# EAGLE design Controlador-ArduUri (EAGLE 9.0.0)
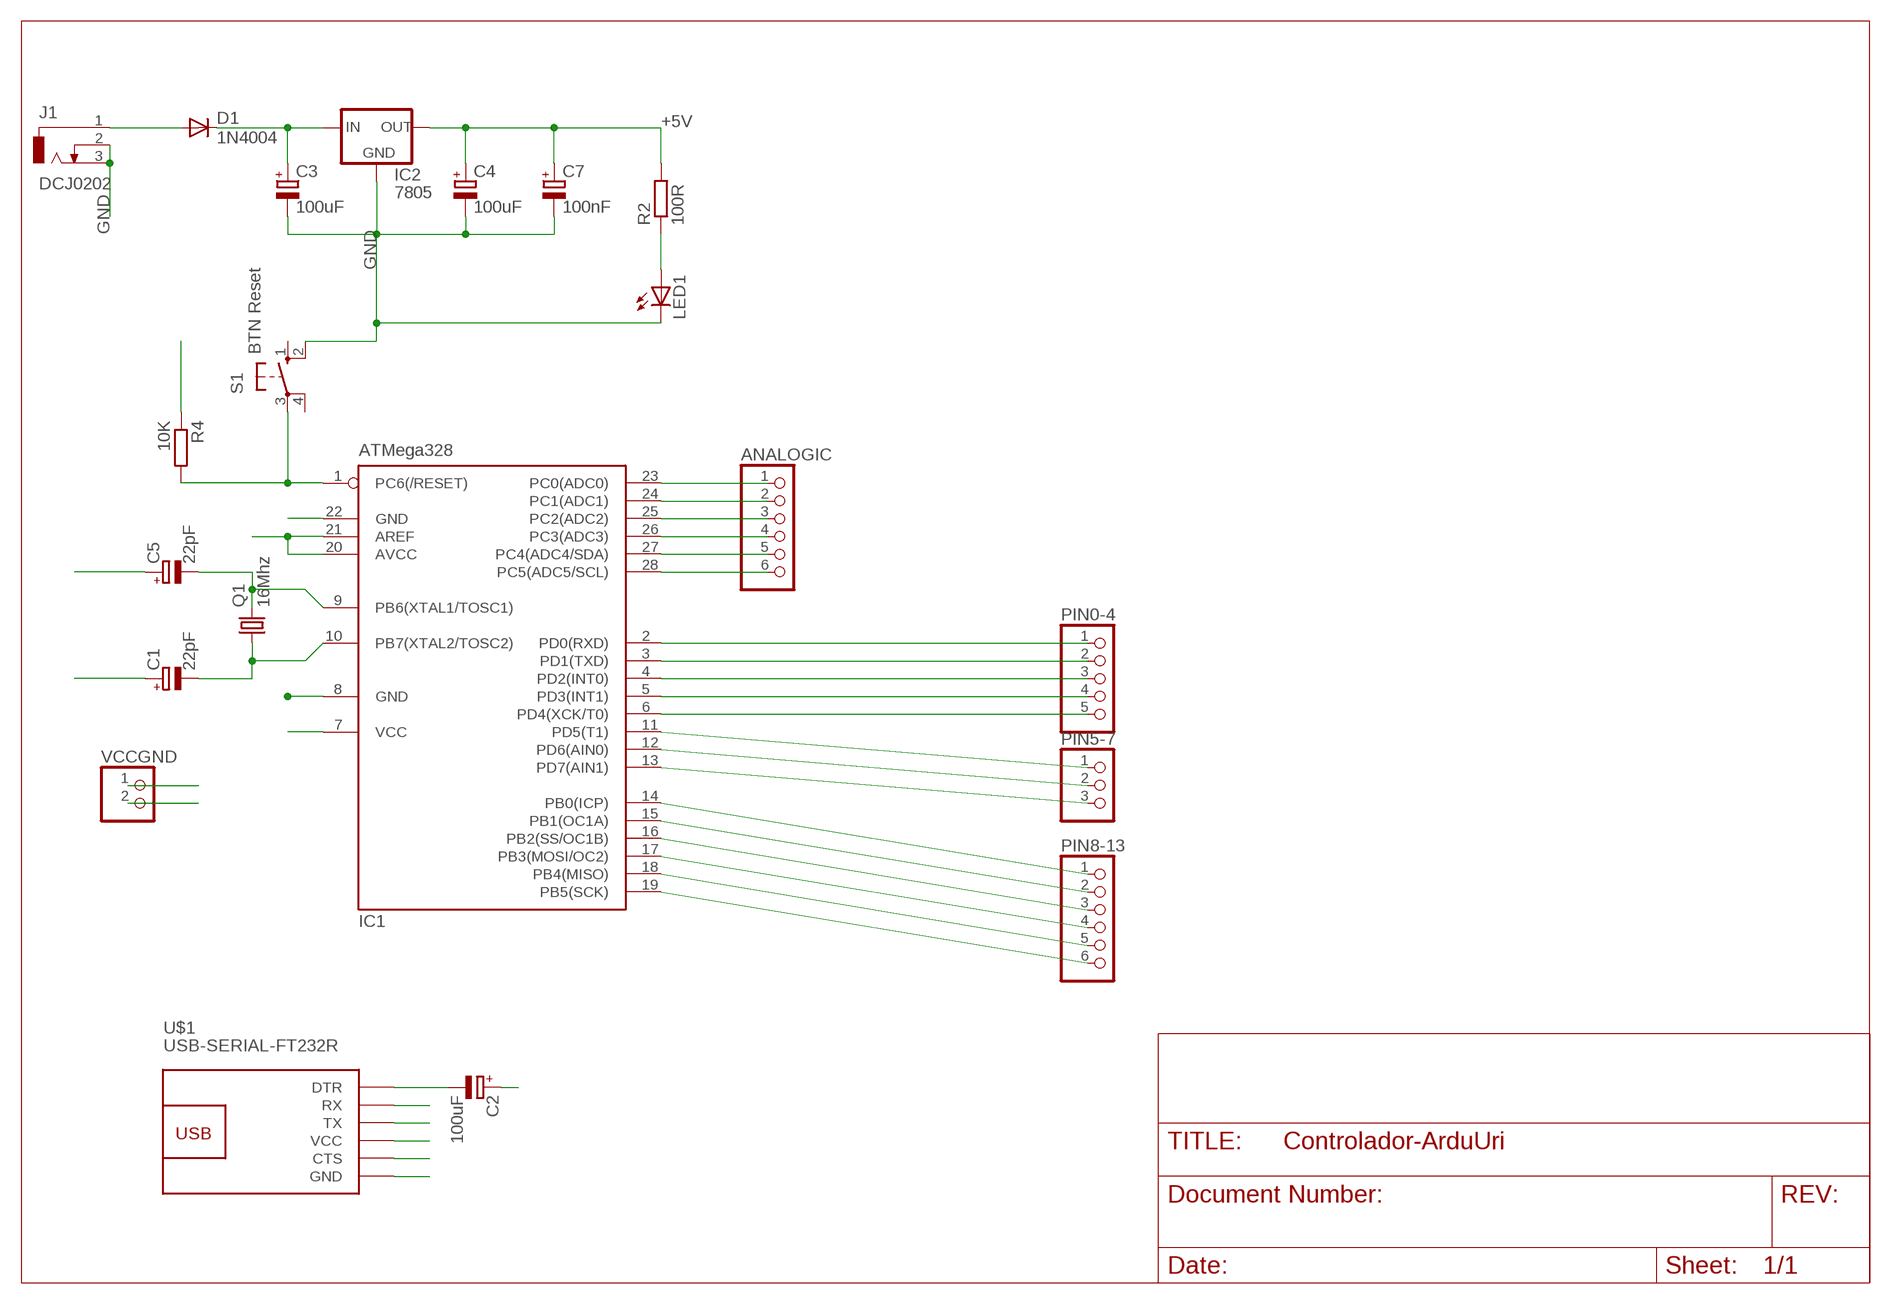
[diagram p0: schematic, sheet 1]

## Parts
ANALOGIC  PINHD-1X6  [1X06]
C1  22pF  CPOL-EUE2.5-5  [E2,5-5]
C2  100uF  CPOL-EUTAP5-50  [TAP5-50]
C3  100uF  CPOL-EUTAP5-50  [TAP5-50]
C4  100uF  CPOL-EUTAP5-50  [TAP5-50]
C5  22pF  CPOL-EUE2.5-5  [E2,5-5]
C7  100nF  CPOL-EUE2.5-5  [E2,5-5]
D1  1N4004  [DO41-10]
IC1  ATMega328  MEGA8-P  [DIL28-3]
IC2  7805  78XXL  [78XXL]
J1  DCJ0202  [DCJ0202]
LED1  LED5MM  [LED5MM]
PIN0-4  PINHD-1X5  [1X05]
PIN5-7  PINHD-1X3  [1X03]
PIN8-13  PINHD-1X6  [1X06]
Q1  16Mhz  CRYSTALHC49S  [HC49/S]
R2  100R  R-EU_0204/7  [0204/7]
R4  10K  R-EU_0204/7  [0204/7]
S1  BTN Reset  10-XX  [B3F-10XX]
U$1  USB-SERIAL-FT232R  [USB-SERIAL-FT232R]
VCCGND  PINHD-1X2  [1X02]

## Nets
+5V: C4.+ C7.+ IC1.7(VCC) IC1.20(AVCC) IC1.21(AREF) IC2.OUT R2.2 R4.1 U$1.4(VCC) VCCGND.1
DTR: C2.- U$1.1(DTR)
GND: C1.+ C3.- C4.- C5.+ C7.- IC1.8(GND) IC1.22(GND) IC2.GND J1.2 J1.3 LED1.K(C) S1.2(S1) U$1.6(GND) VCCGND.2
M1-A1: IC1.17(PB3(MOSI/OC2)) PIN8-13.4
M1-B1: IC1.16(PB2(SS/OC1B)) PIN8-13.3
M2-A1: IC1.12(PD6(AIN0)) PIN5-7.2
M2-B1: IC1.11(PD5(T1)) PIN5-7.1
N$1: C5.- IC1.9(PB6(XTAL1/TOSC1)) Q1.2
N$2: C1.- IC1.10(PB7(XTAL2/TOSC2)) Q1.1
N$5: D1.A J1.1
N$6: C3.+ D1.C IC2.IN
N$20: ANALOGIC.1 IC1.23(PC0(ADC0))
N$21: ANALOGIC.2 IC1.24(PC1(ADC1))
N$22: ANALOGIC.3 IC1.25(PC2(ADC2))
N$23: ANALOGIC.4 IC1.26(PC3(ADC3))
N$24: ANALOGIC.5 IC1.27(PC4(ADC4/SDA))
N$25: ANALOGIC.6 IC1.28(PC5(ADC5/SCL))
N$28: IC1.4(PD2(INT0)) PIN0-4.3
N$29: IC1.5(PD3(INT1)) PIN0-4.4
N$30: IC1.6(PD4(XCK/T0)) PIN0-4.5
N$31: IC1.13(PD7(AIN1)) PIN5-7.3
N$32: IC1.14(PB0(ICP)) PIN8-13.1
N$33: IC1.15(PB1(OC1A)) PIN8-13.2
N$34: IC1.18(PB4(MISO)) PIN8-13.5
N$35: IC1.19(PB5(SCK)) PIN8-13.6
N$40: U$1.5(CTS)
N$48: LED1.A R2.1
RESET: C2.+ IC1.1(PC6(/RESET)) R4.2 S1.3(P)
RX: IC1.2(PD0(RXD)) PIN0-4.1 U$1.3(TX)
TX: IC1.3(PD1(TXD)) PIN0-4.2 U$1.2(RX)
Unconnected: S1.1(S) S1.4(P1)

## Library data of the parts
ANALOGIC PIN8-13 = pinhead:PINHD-1X6: PIN HEADER
C1-C5 C7 = rcl:CPOL-EU: POLARIZED CAPACITOR, European symbol
D1 = diode:1N4004: DIODE general purpose rectifier, 1 A
IC1 = atmel:MEGA8-P: MICROCONTROLLER 8 Kbytes FLASH, 1 kbytes SRAM, 512 bytes EEPROM, USART, 4-channel 10 bit ADC, 2-channel 8 bit ADC Pin compatible with Atmega48, ATMega88, ATMega168 Source: avr.lbr; OC_FARNELL: unknown; OC_NEWARK: unknown
IC2 = v-reg:78XXL: VOLTAGE REGULATOR
J1 = con-jack:DCJ0202: DC POWER JACK Source: DCJ0202.pdf; OC_FARNELL: unknown; OC_NEWARK: unknown
LED1 = led:LED: LED OSRAM: - CHIPLED LG R971, LG N971, LY N971, LG Q971, LY Q971, LO R971, LY R971 LH N974, LH R974 LS Q976, LO Q976, LY Q976 LO Q996 - Hyper CHIPLED LW Q18S LB Q993, LB Q99A, LB R99A - SideLED LS A670, LO A670, LY A670, LG A670, LP A670 LB A673, LV A673, LT A673, LW A673 LH A674 LY A675 LS A676, LA A676, LO A676, LY A676, LW A676 LS A679, LY A679, LG A679 - Hyper Micro SIDELED® LS Y876, LA Y876, LO Y876, LY Y876 LT Y87S - SmartLED LW L88C, LW L88S LB L89C, LB L89S, LG L890 LS L89K, LO L89K, LY L89K LS L896, LA L896, LO L896, LY L896 - TOPLED LS T670, LO T670, LY T670, LG T670, LP T670 LSG T670, LSP T670, LSY T670, LOP T670, LYG T670 LG T671, LOG T671, LSG T671 LB T673, LV T673, LT T673, LW T673 LH T674 LS T676, LA T676, LO T676, LY T676, LB T676, LH T676, LSB T676, LW T676 LB T67C, LV T67C, LT T67C, LS T67K, LO T67K, LY T67K, LW E67C LS E67B, LA E67B, LO E67B, LY E67B, LB E67C, LV E67C, LT E67C LW T67C LS T679, LY T679, LG T679 LS T770, LO T770, LY T770, LG T770, LP T770 LB T773, LV T773, LT T773, LW T773 LH T774 LS E675, LA E675, LY E675, LS T675 LS T776, LA T776, LO T776, LY T776, LB T776 LHGB T686 LT T68C, LB T68C - Hyper Mini TOPLED® LB M676 - Mini TOPLED Santana® LG M470 LS M47K, LO M47K, LY M47K Source: http://www.osram.convergy.de LUXEON: - LUMILED® LXK2-PW12-R00, LXK2-PW12-S00, LXK2-PW14-U00, LXK2-PW14-V00 LXK2-PM12-R00, LXK2-PM12-S00, LXK2-PM14-U00 LXK2-PE12-Q00, LXK2-PE12-R00, LXK2-PE12-S00, LXK2-PE14-T00, LXK2-PE14-U00 LXK2-PB12-K00, LXK2-PB12-L00, LXK2-PB12-M00, LXK2-PB14-N00, LXK2-PB14-P00, LXK2-PB14-Q00 LXK2-PR12-L00, LXK2-PR12-M00, LXK2-PR14-Q00, LXK2-PR14-R00 LXK2-PD12-Q00, LXK2-PD12-R00, LXK2-PD12-S00 LXK2-PH12-R00, LXK2-PH12-S00 LXK2-PL12-P00, LXK2-PL12-Q00, LXK2-PL12-R00 Source: www.luxeon.com KINGBRIGHT: KA-3528ASYC Source: www.kingbright.com
PIN0-4 = pinhead:PINHD-1X5: PIN HEADER
PIN5-7 = pinhead:PINHD-1X3: PIN HEADER
Q1 = crystal:CRYSTAL: CRYSTAL; OC_FARNELL: 1667008; OC_NEWARK: unknown
R2 R4 = rcl:R-EU_: RESISTOR, European symbol
S1 = switch-omron:10-XX: OMRON SWITCH; MPN: B3F-1000; OC_FARNELL: 176432; OC_NEWARK: 36M3542
U$1 = diy-modules:USB-SERIAL-FT232R: USB to Serial UART Converter based on FT232R chip More information about FT232R chip is available here: http://www.ftdichip.com/Products/ICs/FT232R.htm Click here to find device on ebay.com <http://www.ebay.com/sch/ft232rl+arduino+download+max232>
VCCGND = pinhead:PINHD-1X2: PIN HEADER

## Board
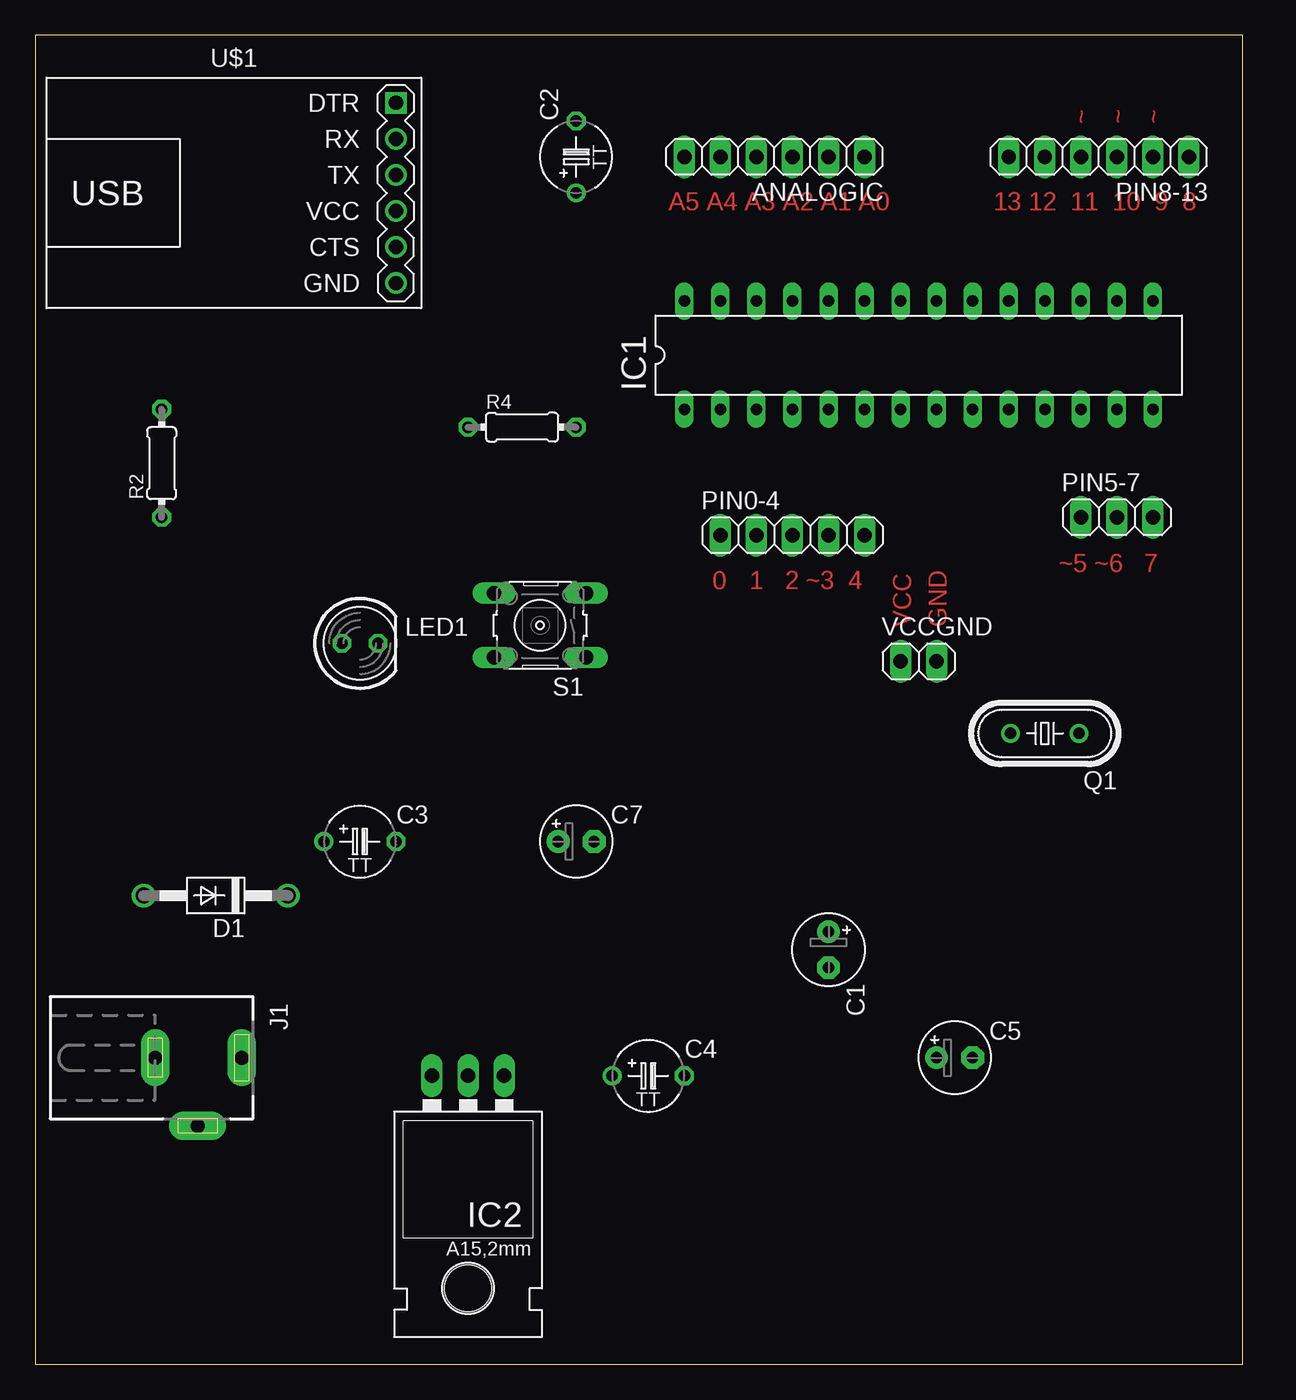
[diagram p1: board, top side]
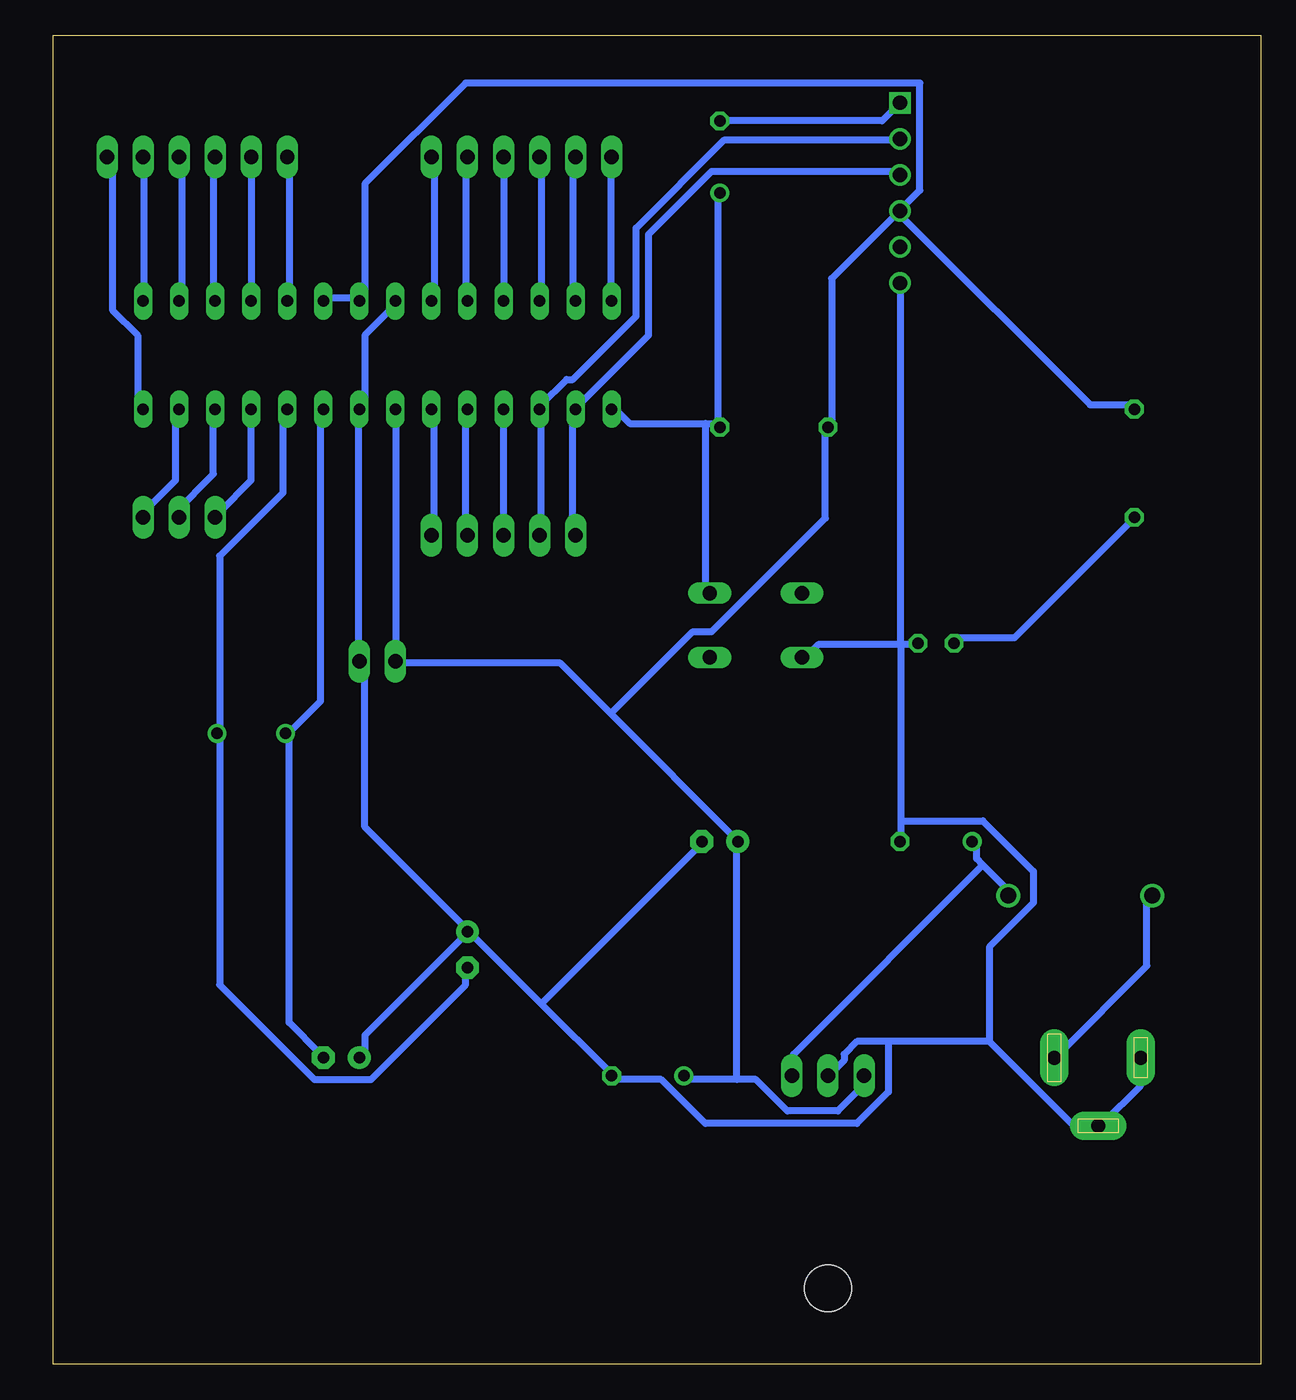
[diagram p2: board, bottom side, seen from below]

Size 85.07 x 93.65 mm. Coordinates in mm from the lower left corner, seen from the top.
Outline: 0,0 85.07,0 85.07,93.65 0,93.65 0,0
Copper layers (1*16): Top 0.035mm / dielectric 1.5mm / Bottom 0.035mm
Design rules "default *": minimum track width 20mil, minimum drill 24mil, track to track 15mil, track to pad 15mil, pad to pad 15mil, via to via 15mil, smd to smd 8mil, copper to edge 40mil, drill to drill 8mil, minimum pad ring 10mil, minimum via ring 8mil, stop-mask expansion 4mil, vias tented up to drill 0mil, thermal gap 10mil

### Footprints (pad centres in the part's own frame; a part is rotated, then mirrored left to right if it is on the bottom)
1X06 = drill 1.016 long: 1 -6.35,0; 2 -3.81,0; 3 -1.27,0; 4 1.27,0; 5 3.81,0; 6 6.35,0
E2,5-5 = drill 0.813 pad 1.6: + -1.27,0 | drill 0.813 pad 1.6 octagon: - 1.27,0
TAP5-50 = drill 0.813: + -2.54,0 | drill 0.813 octagon: - 2.54,0
DO41-10 = drill 1.118: A 5.08,0; C -5.08,0
DIL28-3 = drill 0.813 long: 1 -16.51,-3.81; 2 -13.97,-3.81; 3 -11.43,-3.81; 4 -8.89,-3.81; 5 -6.35,-3.81; 6 -3.81,-3.81; 7 -1.27,-3.81; 8 1.27,-3.81; 9 3.81,-3.81; 10 6.35,-3.81; 11 8.89,-3.81; 12 11.43,-3.81; 13 13.97,-3.81; 14 16.51,-3.81; 15 16.51,3.81; 16 13.97,3.81; 17 11.43,3.81; 18 8.89,3.81; 19 6.35,3.81; 20 3.81,3.81; 21 1.27,3.81; 22 -1.27,3.81; 23 -3.81,3.81; 24 -6.35,3.81; 25 -8.89,3.81; 26 -11.43,3.81; 27 -13.97,3.81; 28 -16.51,3.81
78XXL = drill 1.016 long: GND 0,-3.81; IN -2.54,-3.81; OUT 2.54,-3.81 | hole 3.302: 0,11.176
DCJ0202 = drill 1 pad 2 long: 1 0,3.1; 2 4.8,0; 3 0,-3
LED5MM = drill 0.813 octagon: A -1.27,0; K 1.27,0
1X05 = drill 1.016 long: 1 -5.08,0; 2 -2.54,0; 3 0,0; 4 2.54,0; 5 5.08,0
1X03 = drill 1.016 long: 1 -2.54,0; 2 0,0; 3 2.54,0
HC49/S = drill 0.813: 1 -2.413,0; 2 2.413,0
0204/7 = drill 0.813 octagon: 1 -3.81,0; 2 3.81,0
B3F-10XX = drill 1.016 long: 1 -3.251,2.261; 2 3.251,2.261; 3 -3.251,-2.261; 4 3.251,-2.261
USB-SERIAL-FT232R = drill 1 square: 1 11.43,6.35 | drill 1: 2 11.43,3.81; 3 11.43,1.27; 4 11.43,-1.27; 5 11.43,-3.81; 6 11.43,-6.35
1X02 = drill 1.016 long: 1 -1.27,0; 2 1.27,0

### Placement (x,y rotation side)
ANALOGIC  52.07,85.09 180 top
C1  55.88,29.21 270 top
C2  38.1,85.09 90 top
C3  22.86,36.83 0 top
C4  43.18,20.32 0 top
C5  64.77,21.59 0 top
C7  38.1,36.83 0 top
D1  12.7,33.02 180 top
IC1  62.23,71.12 0 top
IC2  30.48,16.51 180 top
J1  11.43,21.59 270 top
LED1  22.86,50.8 0 top
PIN0-4  53.34,58.42 0 top
PIN5-7  76.2,59.69 0 top
PIN8-13  74.93,85.09 180 top
Q1  71.12,44.45 180 top
R2  8.89,63.5 90 top
R4  34.29,66.04 0 top
S1  35.56,52.07 180 top
U$1  13.97,82.55 0 top
VCCGND  62.23,49.53 0 top

### Tracks (layer width: path | path; a pad name or v marks a point on that pad's centre or on a via)
+5V
  Bottom 0.508: IC1.20 65.79,75.18 63.56,75.18 IC1.21 63.12,75.18 63.12,83.19 56.01,90.3 24,90.3 24,82.74 25.34,81.41 U$1.4 | U$1.4 25.78,80.96 30.23,76.52 30.23,66.29 R4.1 30.67,65.85 30.67,59.63 38.67,51.62 40.01,51.62 45.78,45.85 | R2.2 8.89,67.63 12,67.63 25.34,80.96 U$1.4 | IC1.7 60.9,67.18 60.9,49.85 VCCGND.1 60.9,49.4 49.34,49.4 45.78,45.85 | 36.89,20.07 35.56,20.07 33.34,17.84 29.78,17.84 27.56,20.07 IC2.OUT | 36.89,20.07 40.45,20.07 C4.+ | 36.89,20.07 36.89,36.51 C7.+ 36.89,36.96 45.78,45.85
DTR
  Bottom 0.508: C2.- 26.67,87.63 U$1.1
GND
  Bottom 0.508: IC1.22 60.9,74.74 63.12,72.52 63.12,67.63 IC1.8 63.56,67.18 63.56,49.85 VCCGND.2 63.12,49.4 63.12,37.85 56.01,30.73 C1.+ | 50.67,25.4 55.56,30.29 C1.+ | 50.67,25.4 45.78,20.51 C4.- 45.34,20.07 42.23,20.07 39.12,16.95 28.45,16.95 26.23,19.18 26.23,22.73 | 50.67,25.4 39.56,36.51 C7.- | C5.+ 63.12,21.84 63.12,23.18 56.01,30.29 C1.+ | 19.11,22.73 26.23,22.73 | 26.23,22.73 28.45,22.73 29.34,21.84 29.34,21.4 30.23,20.51 IC2.GND | 19.11,22.73 13.34,16.95 11.56,16.95 J1.2 11.11,16.95 8.45,19.62 8.45,21.4 J1.3 | 25.34,50.74 31.11,50.74 32,49.85 S1.2 | 25.34,50.74 24.45,50.74 LED1.K | 25.34,50.74 25.34,38.29 | 25.34,38.29 25.34,36.96 C3.- | 25.34,50.74 25.34,76.07 U$1.6 | 19.11,22.73 19.11,29.4 16,32.51 16,34.73 19.56,38.29 25.34,38.29
M1-A1
  Bottom 0.508: IC1.17 73.79,75.18 73.79,84.96 PIN8-13.4
M1-B1
  Bottom 0.508: IC1.16 76.01,75.18 76.01,84.96 PIN8-13.3
M2-A1
  Bottom 0.508: IC1.12 73.79,67.18 73.79,62.74 76.45,60.07 PIN5-7.2
M2-B1
  Bottom 0.508: IC1.11 71.12,62.29 73.34,60.07 PIN5-7.1
N$1
  Bottom 0.508: C5.- 66.23,21.84 68.45,24.07 68.45,44.07 Q1.2 68.45,44.51 66.23,46.74 66.23,67.18 IC1.9
N$2
  Bottom 0.508: IC1.10 68.9,67.18 68.9,61.4 73.34,56.96 73.34,44.51 Q1.1 73.34,44.07 73.34,26.73 66.67,20.07 62.67,20.07 56.01,26.73 56.01,27.62 C1.-
N$5
  Bottom 0.508: D1.A 8,32.96 8,28.07 14.22,21.84 J1.1
N$6
  Bottom 0.508: 19.56,35.18 17.78,33.4 D1.C | 19.56,35.18 20,35.62 20,36.51 C3.+ | 19.56,35.18 32.89,21.84 32.89,20.51 IC2.IN
N$20
  Bottom 0.508: IC1.23 58.23,75.18 58.23,84.96 ANALOGIC.1
N$21
  Bottom 0.508: IC1.24 56.01,75.18 56.01,84.96 ANALOGIC.2
N$22
  Bottom 0.508: ANALOGIC.3 IC1.25
N$23
  Bottom 0.508: IC1.26 50.67,75.18 50.67,84.96 ANALOGIC.4
N$24
  Bottom 0.508: IC1.27 48.45,75.18 48.45,84.96 ANALOGIC.5
N$25
  Bottom 0.508: IC1.28 45.78,75.18 45.78,84.96 ANALOGIC.6
N$28
  Bottom 0.508: PIN0-4.3 IC1.4
N$29
  Bottom 0.508: IC1.5 56.01,67.18 56.01,58.74 PIN0-4.4
N$30
  Bottom 0.508: IC1.6 58.23,67.18 58.23,58.74 PIN0-4.5
N$31
  Bottom 0.508: IC1.13 76.45,67.18 76.45,62.29 78.68,60.07 PIN5-7.3
N$32
  Bottom 0.508: IC1.14 79.12,67.63 79.12,72.52 80.9,74.3 80.9,84.96 PIN8-13.1
N$33
  Bottom 0.508: IC1.15 78.68,75.18 78.68,84.96 PIN8-13.2
N$34
  Bottom 0.508: PIN8-13.5 IC1.18
N$35
  Bottom 0.508: IC1.19 68.45,75.18 68.45,84.96 PIN8-13.6
N$48
  Bottom 0.508: LED1.A 21.34,51.18 17.34,51.18 8.89,59.63 R2.1
RESET
  Bottom 0.508: 39.12,66.29 44.45,66.29 45.34,67.18 IC1.1 | 39.12,66.29 38.23,66.29 | 38.23,66.29 38.23,82.3 C2.+ | 38.23,66.29 R4.2 | 39.12,66.29 39.12,54.74 S1.3
RX
  Bottom 0.508: PIN0-4.1 48.45,58.74 48.45,67.18 IC1.2 48.01,67.63 43.12,72.52 43.12,79.63 38.67,84.07 25.78,84.07 U$1.3
TX
  Bottom 0.508: PIN0-4.2 50.67,58.74 50.67,67.18 IC1.3 50.67,67.63 48.9,69.41 48.45,69.41 44.01,73.85 44.01,80.07 37.78,86.3 25.78,86.3 U$1.2

### Text on the board
Top: ~ | ~ | ~ | A5 A4 A3 A2 A1 A0 | 13 12 11 10 9 8 | ~5 ~6 7 | 0 | 1 | 2 ~3 4 | VCC | GND